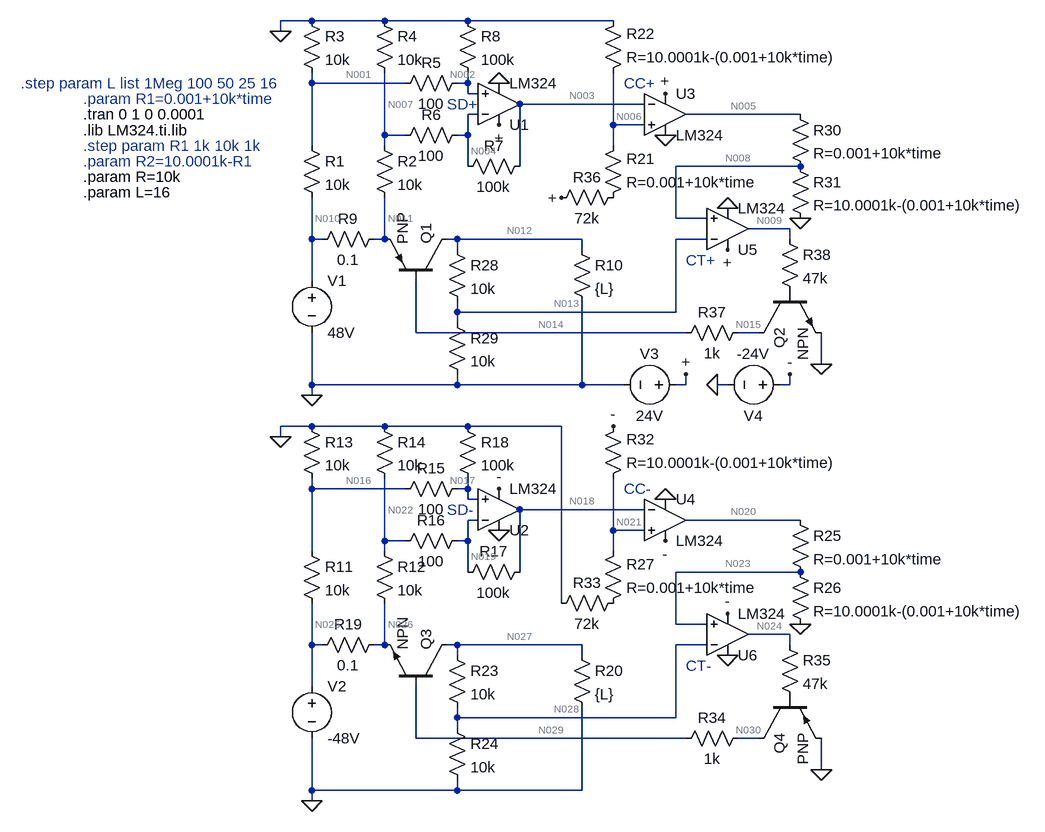
[diagram p0: schematic PSU_final.asc]
PSU_final.asc, the LTspice schematic file:
Version 4
SHEET 1 1280 1104
WIRE -96 -144 -144 -144
WIRE 16 -144 -96 -144
WIRE 144 -144 16 -144
WIRE 368 -144 144 -144
WIRE -144 -128 -144 -144
WIRE -96 -48 -96 -64
WIRE 48 -48 -96 -48
WIRE 144 -48 144 -64
WIRE 144 -48 128 -48
WIRE 144 -32 144 -48
WIRE 160 -32 144 -32
WIRE 416 -16 224 -16
WIRE 160 0 144 0
WIRE 656 0 480 0
WIRE 368 16 368 -64
WIRE 416 16 368 16
WIRE 16 32 16 -64
WIRE 48 32 16 32
WIRE 144 32 144 0
WIRE 144 32 128 32
WIRE -96 48 -96 -48
WIRE 16 48 16 32
WIRE 368 48 368 16
WIRE 144 80 144 32
WIRE 224 80 224 -16
WIRE 656 80 464 80
WIRE 464 160 464 80
WIRE 512 160 464 160
WIRE 640 176 576 176
WIRE -96 192 -96 128
WIRE -80 192 -96 192
WIRE 16 192 16 128
WIRE 16 192 0 192
WIRE 128 192 112 192
WIRE 320 192 128 192
WIRE 512 192 464 192
WIRE 640 192 640 176
WIRE 128 208 128 192
WIRE 320 208 320 192
WIRE -96 256 -96 192
WIRE 128 304 128 288
WIRE 464 304 464 192
WIRE 464 304 128 304
WIRE 128 320 128 304
WIRE 64 336 64 256
WIRE 480 336 64 336
WIRE 592 336 560 336
WIRE 688 384 688 336
WIRE -96 416 -96 336
WIRE 128 416 128 400
WIRE 128 416 -96 416
WIRE 320 416 320 288
WIRE 320 416 128 416
WIRE 384 416 320 416
WIRE 480 416 480 400
WIRE 480 416 464 416
WIRE 544 416 528 416
WIRE 640 416 640 400
WIRE 640 416 624 416
WIRE -96 432 -96 416
WIRE -96 480 -144 480
WIRE 16 480 -96 480
WIRE 144 480 16 480
WIRE 288 480 144 480
WIRE -144 496 -144 480
WIRE -96 576 -96 560
WIRE 48 576 -96 576
WIRE 144 576 144 560
WIRE 144 576 128 576
WIRE 144 592 144 576
WIRE 160 592 144 592
WIRE 416 608 224 608
WIRE 160 624 144 624
WIRE 656 624 480 624
WIRE 368 640 368 560
WIRE 416 640 368 640
WIRE 16 656 16 560
WIRE 48 656 16 656
WIRE 144 656 144 624
WIRE 144 656 128 656
WIRE -96 672 -96 576
WIRE 16 672 16 656
WIRE 368 672 368 640
WIRE 144 704 144 656
WIRE 224 704 224 608
WIRE 656 704 464 704
WIRE 288 752 288 480
WIRE 464 784 464 704
WIRE 512 784 464 784
WIRE 640 800 576 800
WIRE -96 816 -96 752
WIRE -80 816 -96 816
WIRE 16 816 16 752
WIRE 16 816 0 816
WIRE 128 816 112 816
WIRE 320 816 128 816
WIRE 512 816 464 816
WIRE 640 816 640 800
WIRE 128 832 128 816
WIRE 320 832 320 816
WIRE -96 880 -96 816
WIRE 128 928 128 912
WIRE 464 928 464 816
WIRE 464 928 128 928
WIRE 128 944 128 928
WIRE 64 960 64 880
WIRE 480 960 64 960
WIRE 592 960 560 960
WIRE 688 1008 688 960
WIRE -96 1040 -96 960
WIRE 128 1040 128 1024
WIRE 128 1040 -96 1040
WIRE 320 1040 320 912
WIRE 320 1040 128 1040
WIRE -96 1056 -96 1040
FLAG -144 -128 0
FLAG -96 432 0
FLAG 288 128 +
FLAG 480 400 +
FLAG 544 208 +
FLAG 192 -48 0
FLAG 448 32 0
FLAG 544 144 0
FLAG 656 160 0
FLAG 192 16 +
FLAG 448 -32 +
FLAG 688 384 0
FLAG 640 400 -
FLAG 528 416 0
FLAG -144 496 0
FLAG -96 1056 0
FLAG 656 784 0
FLAG 688 1008 0
FLAG 192 576 -
FLAG 448 656 -
FLAG 544 768 -
FLAG 192 640 0
FLAG 448 592 0
FLAG 544 832 0
FLAG 368 480 -
SYMBOL res -112 32 R0
SYMATTR InstName R1
SYMATTR Value 10k
SYMBOL res 0 32 R0
SYMATTR InstName R2
SYMATTR Value 10k
SYMBOL res -112 -160 R0
SYMATTR InstName R3
SYMATTR Value 10k
SYMBOL res 0 -160 R0
SYMATTR InstName R4
SYMATTR Value 10k
SYMBOL res 144 -64 R90
WINDOW 0 0 56 VBottom 2
WINDOW 3 32 56 VTop 2
SYMATTR InstName R5
SYMATTR Value 100
SYMBOL res 144 16 R90
WINDOW 0 0 56 VBottom 2
WINDOW 3 32 56 VTop 2
SYMATTR InstName R6
SYMATTR Value 100
SYMBOL res 240 64 R90
WINDOW 0 0 56 VBottom 2
WINDOW 3 32 56 VTop 2
SYMATTR InstName R7
SYMATTR Value 100k
SYMBOL res 128 -160 R0
SYMATTR InstName R8
SYMATTR Value 100k
SYMBOL res 16 176 R90
WINDOW 0 0 56 VBottom 2
WINDOW 3 32 56 VTop 2
SYMATTR InstName R9
SYMATTR Value 0.1
SYMBOL res 304 192 R0
SYMATTR InstName R10
SYMATTR Value {L}
SYMBOL voltage 480 416 R90
WINDOW 0 -32 56 VBottom 2
WINDOW 3 32 56 VTop 2
WINDOW 123 0 0 Left 0
WINDOW 39 0 0 Left 0
SYMATTR InstName V3
SYMATTR Value 24V
SYMBOL res 112 192 R0
SYMATTR InstName R28
SYMATTR Value 10k
SYMBOL res 112 304 R0
SYMATTR InstName R29
SYMATTR Value 10k
SYMBOL res 640 -16 R0
SYMATTR InstName R30
SYMATTR Value R=0.001+10k*time
SYMBOL res 640 64 R0
SYMATTR InstName R31
SYMATTR Value R=10.0001k-(0.001+10k*time)
SYMBOL res 352 144 M180
WINDOW 0 36 76 Left 2
WINDOW 3 36 40 Left 2
SYMATTR InstName R21
SYMATTR Value R=0.001+10k*time
SYMBOL res 352 -48 M180
WINDOW 0 36 76 Left 2
WINDOW 3 36 40 Left 2
SYMATTR InstName R22
SYMATTR Value R=10.0001k-(0.001+10k*time)
SYMBOL voltage -96 240 R0
WINDOW 123 0 0 Left 0
WINDOW 39 0 0 Left 0
SYMATTR InstName V1
SYMATTR Value 48V
SYMBOL OpAmps\\opamp2 192 48 M180
SYMATTR InstName U1
SYMATTR Value LM324
SYMBOL OpAmps\\opamp2 448 -64 R0
SYMATTR InstName U3
SYMATTR Value LM324
SYMBOL OpAmps\\opamp2 544 240 M180
SYMATTR InstName U5
SYMATTR Value LM324
SYMBOL res 384 112 R90
WINDOW 0 0 56 VBottom 2
WINDOW 3 32 56 VTop 2
SYMATTR InstName R36
SYMATTR Value 72k
SYMBOL npn 592 272 M90
SYMATTR InstName Q2
SYMBOL pnp 112 256 M270
SYMATTR InstName Q1
SYMBOL res 576 320 R90
WINDOW 0 0 56 VBottom 2
WINDOW 3 32 56 VTop 2
SYMATTR InstName R37
SYMATTR Value 1k
SYMBOL res 624 176 R0
SYMATTR InstName R38
SYMATTR Value 47k
SYMBOL voltage 640 416 R90
WINDOW 0 32 56 VTop 2
WINDOW 3 -32 56 VBottom 2
WINDOW 123 0 0 Left 0
WINDOW 39 0 0 Left 0
SYMATTR InstName V4
SYMATTR Value -24V
SYMBOL res -112 656 R0
SYMATTR InstName R11
SYMATTR Value 10k
SYMBOL res 0 656 R0
SYMATTR InstName R12
SYMATTR Value 10k
SYMBOL res -112 464 R0
SYMATTR InstName R13
SYMATTR Value 10k
SYMBOL res 0 464 R0
SYMATTR InstName R14
SYMATTR Value 10k
SYMBOL res 144 560 R90
WINDOW 0 0 56 VBottom 2
WINDOW 3 32 56 VTop 2
SYMATTR InstName R15
SYMATTR Value 100
SYMBOL res 144 640 R90
WINDOW 0 0 56 VBottom 2
WINDOW 3 32 56 VTop 2
SYMATTR InstName R16
SYMATTR Value 100
SYMBOL res 240 688 R90
WINDOW 0 0 56 VBottom 2
WINDOW 3 32 56 VTop 2
SYMATTR InstName R17
SYMATTR Value 100k
SYMBOL res 128 464 R0
SYMATTR InstName R18
SYMATTR Value 100k
SYMBOL res 16 800 R90
WINDOW 0 0 56 VBottom 2
WINDOW 3 32 56 VTop 2
SYMATTR InstName R19
SYMATTR Value 0.1
SYMBOL res 304 816 R0
SYMATTR InstName R20
SYMATTR Value {L}
SYMBOL res 112 816 R0
SYMATTR InstName R23
SYMATTR Value 10k
SYMBOL res 112 928 R0
SYMATTR InstName R24
SYMATTR Value 10k
SYMBOL res 640 608 R0
SYMATTR InstName R25
SYMATTR Value R=0.001+10k*time
SYMBOL res 640 688 R0
SYMATTR InstName R26
SYMATTR Value R=10.0001k-(0.001+10k*time)
SYMBOL res 352 768 M180
WINDOW 0 36 76 Left 2
WINDOW 3 36 40 Left 2
SYMATTR InstName R27
SYMATTR Value R=0.001+10k*time
SYMBOL res 352 576 M180
WINDOW 0 36 76 Left 2
WINDOW 3 36 40 Left 2
SYMATTR InstName R32
SYMATTR Value R=10.0001k-(0.001+10k*time)
SYMBOL OpAmps\\opamp2 192 672 M180
SYMATTR InstName U2
SYMATTR Value LM324
SYMBOL OpAmps\\opamp2 448 560 R0
SYMATTR InstName U4
SYMATTR Value LM324
SYMBOL OpAmps\\opamp2 544 864 M180
SYMATTR InstName U6
SYMATTR Value LM324
SYMBOL res 384 736 R90
WINDOW 0 0 56 VBottom 2
WINDOW 3 32 56 VTop 2
SYMATTR InstName R33
SYMATTR Value 72k
SYMBOL res 576 944 R90
WINDOW 0 0 56 VBottom 2
WINDOW 3 32 56 VTop 2
SYMATTR InstName R34
SYMATTR Value 1k
SYMBOL res 624 800 R0
SYMATTR InstName R35
SYMATTR Value 47k
SYMBOL voltage -96 864 R0
WINDOW 123 0 0 Left 0
WINDOW 39 0 0 Left 0
SYMATTR InstName V2
SYMATTR Value -48V
SYMBOL npn 112 880 M270
SYMATTR InstName Q3
SYMBOL pnp 592 896 M90
SYMATTR InstName Q4
TEXT -448 0 Left 2 !.tran 0 1 0 0.0001
TEXT -448 24 Left 2 !.lib LM324.ti.lib
TEXT 112 -16 Left 2 ;SD+
TEXT 480 224 Left 2 ;CT+
TEXT 384 -48 Left 2 ;CC+
TEXT -448 48 Left 2 ;.step param R1 1k 10k 1k
TEXT -448 96 Left 2 !.param R=10k
TEXT -544 -48 Left 2 ;.step param L list 1Meg 100 50 25 16
TEXT -448 72 Left 2 ;.param R2=10.0001k-R1
TEXT -448 -24 Left 2 ;.param R1=0.001+10k*time
TEXT -448 120 Left 2 !.param L=16
TEXT 112 608 Left 2 ;SD-
TEXT 480 848 Left 2 ;CT-
TEXT 384 576 Left 2 ;CC-

The netlist it stands for:
* PSU_final.asc
R1 N001 N010 10k
R2 N007 N011 10k
R3 0 N001 10k
R4 0 N007 10k
R5 N002 N001 100
R6 N004 N007 100
R7 N003 N004 100k
R8 0 N002 100k
R9 N011 N010 0.1
R10 N012 0 {L}
V3 + 0 24V
R28 N012 N013 10k
R29 N013 0 10k
R30 N005 N008 R=0.001+10k*time
R31 N008 0 R=10.0001k-(0.001+10k*time)
R21 P001 N006 R=0.001+10k*time
R22 N006 0 R=10.0001k-(0.001+10k*time)
V1 N010 0 48V
XU1 N002 N004 + 0 N003 LM324  ; pins In+ In- V+ V- OUT
XU3 N006 N003 + 0 N005 LM324  ; pins In+ In- V+ V- OUT
XU5 N008 N013 + 0 N009 LM324  ; pins In+ In- V+ V- OUT
R36 P001 + 72k
Q2 N015 P002 0 0 NPN
Q1 N012 N014 N011 0 PNP
R37 N015 N014 1k
R38 N009 P002 47k
V4 - 0 -24V
R11 N016 N025 10k
R12 N022 N026 10k
R13 0 N016 10k
R14 0 N022 10k
R15 N017 N016 100
R16 N019 N022 100
R17 N018 N019 100k
R18 0 N017 100k
R19 N026 N025 0.1
R20 N027 0 {L}
R23 N027 N028 10k
R24 N028 0 10k
R25 N020 N023 R=0.001+10k*time
R26 N023 0 R=10.0001k-(0.001+10k*time)
R27 P003 N021 R=0.001+10k*time
R32 N021 - R=10.0001k-(0.001+10k*time)
XU2 N017 N019 0 - N018 LM324  ; pins In+ In- V+ V- OUT
XU4 N021 N018 0 - N020 LM324  ; pins In+ In- V+ V- OUT
XU6 N023 N028 0 - N024 LM324  ; pins In+ In- V+ V- OUT
R33 P003 0 72k
R34 N030 N029 1k
R35 N024 P004 47k
V2 N025 0 -48V
Q3 N027 N029 N026 0 NPN
Q4 N030 P004 0 0 PNP
.model NPN NPN
.model PNP PNP
.lib standard.bjt
.tran 0 1 0 0.0001
.lib LM324.ti.lib
* SD+
* CT+
* CC+
* .step param R1 1k 10k 1k
.param R=10k
* .step param L list 1Meg 100 50 25 16
* .param R2=10.0001k-R1
* .param R1=0.001+10k*time
.param L=16
* SD-
* CT-
* CC-
.backanno
.end

* Results of the author's LTspice run, read from the files saved beside the schematic
* Operating Point, zero values left out:
*   V(n001) = 22.86 V
*   V(n010) = 48 V
*   V(n007) = 22.85 V
*   V(n011) = 47.72 V
*   V(n002) = 22.84 V
*   V(n004) = 22.83 V
*   V(n003) = 2.777 V
*   V(n012) = 44.99 V
*   V(+) = 24 V
*   V(n013) = 22.5 V
*   V(n005) = 22.5 V
*   V(n008) = 22.5 V
*   V(p001) = 2.927 V
*   V(n006) = 2.927 V
*   V(n009) = 14.09 V
*   V(n015) = 18.59 V
*   V(p002) = 860.5 mV
*   V(n014) = 46.74 V
*   V(-) = -24 V
*   V(n016) = -22.86 V
*   V(n025) = -48 V
*   V(n022) = -22.85 V
*   V(n026) = -47.7 V
*   V(n017) = -22.84 V
*   V(n019) = -22.83 V
*   V(n018) = -2.955 V
*   V(n027) = -47.56 V
*   V(n028) = -23.78 V
*   V(n020) = -24 V
*   V(n023) = -24 V
*   V(p003) = -21.07 V
*   V(n021) = -21.07 V
*   V(n024) = -24 V
*   V(n030) = -193.5 mV
*   V(n029) = -46.72 V
*   V(p004) = -873.6 mV
*   I(R30) = 2.25 mA
*   I(R31) = 2.25 mA
*   I(R21) = 292.7 µA
*   I(R22) = 292.7 µA
*   I(R25) = -2.4 mA
*   I(R26) = -2.4 mA
*   I(R27) = 292.7 µA
*   I(R32) = 292.7 µA
*   Ic(Q2) = 28.14 mA
*   Ib(Q2) = 281.4 µA
*   Ie(Q2) = -28.42 mA
*   Ic(Q3) = 2.975 A
*   Ib(Q3) = 46.52 mA
*   Ie(Q3) = -3.022 A
*   Ic(Q1) = -2.814 A
*   Ib(Q1) = -28.14 mA
*   Ie(Q1) = 2.842 A
*   Ic(Q4) = -46.52 mA
*   Ib(Q4) = -492 µA
*   Ie(Q4) = 47.01 mA
*   I(R1) = -2.514 mA
*   I(R2) = -2.486 mA
*   I(R3) = -2.286 mA
*   I(R4) = -2.285 mA
*   I(R5) = -228.3 µA
*   I(R6) = -200.6 µA
*   I(R7) = -200.6 µA
*   I(R8) = -228.4 µA
*   I(R9) = -2.845 A
*   I(R10) = 2.812 A
*   I(R28) = 2.25 mA
*   I(R29) = 2.25 mA
*   I(R36) = -292.7 µA
*   I(R37) = -28.14 mA
*   I(R38) = 281.4 µA
*   I(R11) = 2.514 mA
*   I(R12) = 2.484 mA
*   I(R13) = 2.286 mA
*   I(R14) = 2.285 mA
*   I(R15) = 228.4 µA
*   I(R16) = 198.8 µA
*   I(R17) = 198.8 µA
*   I(R18) = 228.4 µA
*   I(R19) = 3.024 A
*   I(R20) = -2.973 A
*   I(R23) = -2.378 mA
*   I(R24) = -2.378 mA
*   I(R33) = -292.7 µA
*   I(R34) = 46.52 mA
*   I(R35) = -492 µA
*   I(V3) = -2.69 mA
*   I(V1) = -2.847 A
*   I(V4) = 2.683 mA
*   I(V2) = 3.027 A
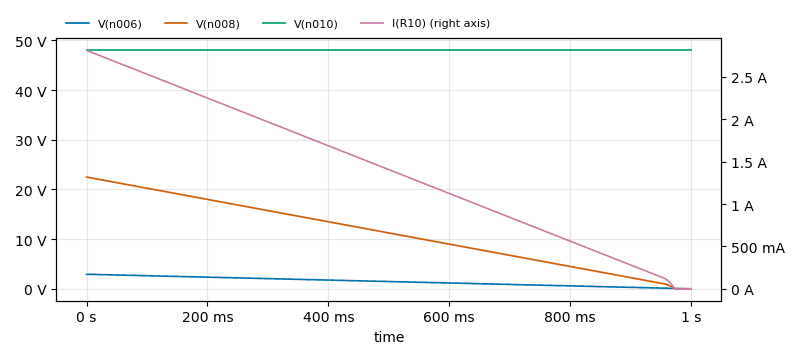
[diagram p1: Transient Analysis of PSU_final.asc, plotted from the saved traces]
* Transient Analysis, 1 run:
*   V(n006): min 28.98 µV, max 2.927 V, average 1.463 V, rms 1.693 V, last 28.98 µV
*   V(n008): min 0 V, max 22.5 V, average 11.23 V, rms 13.01 V, last 0 V
*   V(n010): min 48 V, max 48 V, average 48 V, rms 48 V, last 48 V
*   I(R10): min 78.02 µA, max 2.812 A, average 1.404 A, rms 1.626 A, last 78.02 µA